# Altium schematic sheet USBC_PD_CC_TUSB320.SchDoc
size A3; SheetNumber: 16; SheetTotal: 22
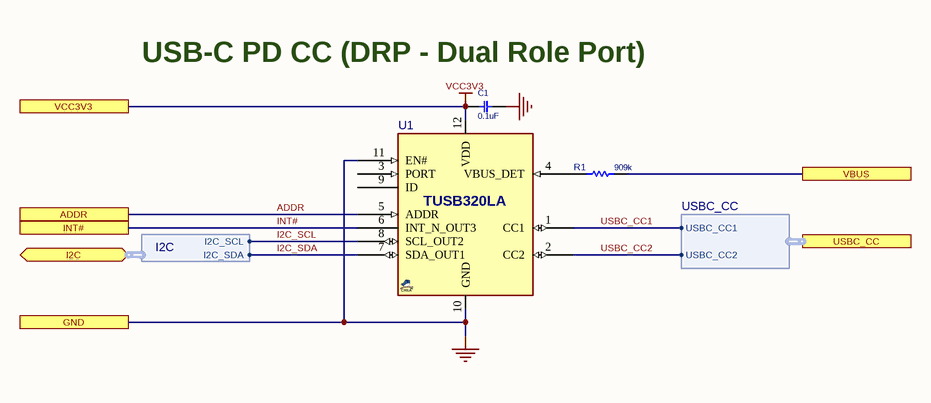
[diagram p0: USBC_PD_CC_TUSB320.SchDoc]

## Parts
C1  0.1uF  [C0201]
R1  909k  [R0402]
U1  TUSB320LA  [QFN40_12_1616]  (value not drawn)

## Ports
ADDR, GND, I2C (bidir, harness I2C), INT#, USBC_CC (harness USBC_CC), VBUS, VCC3V3

## Harnesses
I2C: I2C_SCL, I2C_SDA
USBC_CC: USBC_CC1, USBC_CC2

## Nets
GND: C1.2 U1.10(GND) U1.11(EN#) ; port GND
VCC3V3: C1.1 U1.12(VDD) ; port VCC3V3
ADDR: U1.5(ADDR) ; port ADDR
I2C_SCL: U1.8(SCL_OUT2) ; port I2C.I2C_SCL
I2C_SDA: U1.7(SDA_OUT1) ; port I2C.I2C_SDA
INT#: U1.6(INT_N_OUT3) ; port INT#
USBC_CC1: U1.1(CC1) ; port USBC_CC.USBC_CC1
USBC_CC2: U1.2(CC2) ; port USBC_CC.USBC_CC2
VBUS: R1.2 ; port VBUS
NetR1_1: R1.1 U1.4(VBUS_DET)

Not connected (* = marked no-connect by the designer): U1 3(PORT) 9(ID)

## Notes on the sheet
- (near C1) USB-C PD CC (DRP - Dual Role Port)

## Library data of the parts
C1 = CAP_SMD_MLCC: CAP, MLCC; PARAM: X5R, 10%; MANF_P#: CL03A104KP3NNWC; MANF: Samsung; PARAM2: 10v; PRICE: 10,000:$0.006; ASSEMBLY: ASSEMBLY; VALUE: 0.1uF
R1 = RES_SMD: RESISTOR, SMD; PARAM: 0.063W; DESC: DESCRIPTION; DIST#: MOUSER; PARAM2: 1%; MANF_P#: -; MANF: -; ASSEMBLY: ASSEMBLY; PRICE: 100= 0.3$; VALUE: 909k
U1 = TUSB320LA_X2QFN12: USB-C PD controller; MANF: Texas Instruments; DESC: DESCRIPTION; MANF_P#: TUSB320LAIRWB; PARAM2: 3~5.5v; MANF: MANF; ASSEMBLY: ASSEMBLY; PRICE: 0.7$; VALUE: TUSB320LA; PACKAGE: X2QFN-12